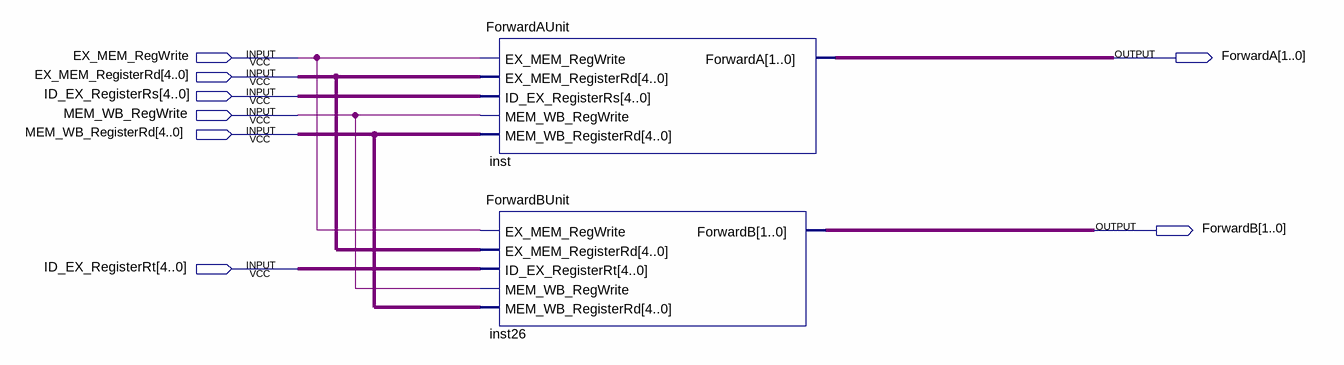
[diagram p0: schematic sheet]
// Quartus schematic ForwardingUnit.bdf as structural Verilog: 2 symbols, 8 pins
module ForwardingUnit (
  input  EX_MEM_RegWrite,
  input  [4:0] EX_MEM_RegisterRd,
  input  [4:0] ID_EX_RegisterRs,
  input  MEM_WB_RegWrite,
  input  [4:0] MEM_WB_RegisterRd,
  input  [4:0] ID_EX_RegisterRt,
  output [1:0] ForwardA,
  output [1:0] ForwardB
);

  ForwardAUnit inst (
    .EX_MEM_RegWrite(EX_MEM_RegWrite), .EX_MEM_RegisterRd(EX_MEM_RegisterRd),
    .ID_EX_RegisterRs(ID_EX_RegisterRs), .MEM_WB_RegWrite(MEM_WB_RegWrite),
    .MEM_WB_RegisterRd(MEM_WB_RegisterRd), .ForwardA(ForwardA));
  ForwardBUnit inst26 (
    .EX_MEM_RegWrite(EX_MEM_RegWrite), .EX_MEM_RegisterRd(EX_MEM_RegisterRd),
    .ID_EX_RegisterRt(ID_EX_RegisterRt), .MEM_WB_RegWrite(MEM_WB_RegWrite),
    .MEM_WB_RegisterRd(MEM_WB_RegisterRd), .ForwardB(ForwardB));
endmodule
